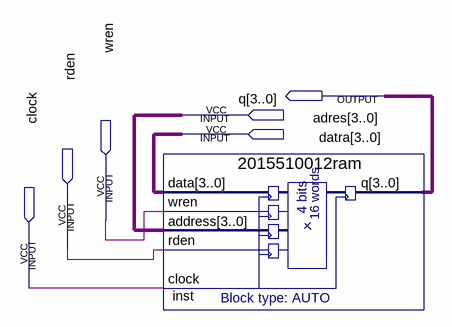
[diagram p0: schematic sheet]
// Quartus schematic 2015510012-ram.bdf as structural Verilog: 1 symbols, 6 pins
module \2015510012-ram  (
  input  [3:0] adres,
  input  [3:0] datra,
  input  wren,
  input  rden,
  input  clock,
  output [3:0] q
);

  \2015510012ram  inst (.data(datra), .wren(wren), .address(adres), .rden(rden), .clock(clock), .q(q));
endmodule
